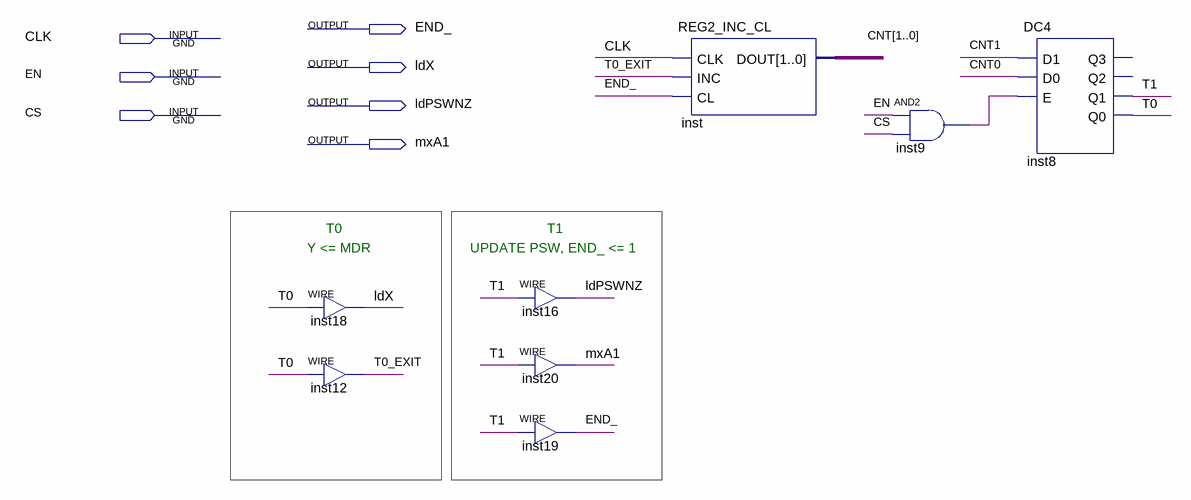
[diagram p0: schematic sheet]
// Quartus schematic LDX.bdf as structural Verilog: 8 symbols, 7 pins
module LDX (
  input  CLK,
  input  EN,
  input  CS,
  output END_,
  output ldX,
  output ldPSWNZ,
  output mxA1
);

  wire inst9_out, T0, T0_EXIT, T1;
  wire [1:0] CNT;

  assign ldX = T0;  // WIRE inst18
  assign T0_EXIT = T0;  // WIRE inst12
  assign ldPSWNZ = T1;  // WIRE inst16
  assign mxA1 = T1;  // WIRE inst20
  assign END_ = T1;  // WIRE inst19
  REG2_INC_CL inst (.CLK(CLK), .INC(T0_EXIT), .CL(END_), .DOUT(CNT));
  and inst9 (inst9_out, EN, CS);
  DC4 inst8 (.D1(CNT[1]), .D0(CNT[0]), .E(inst9_out), .Q1(T1), .Q0(T0));  // open: Q3, Q2

  // Notes on the sheet:
  //   T0
  //   T1
  //   Y <= MDR
  //   UPDATE PSW, END_ <= 1
endmodule
